# EAGLE design openfc (EAGLE 6.2)
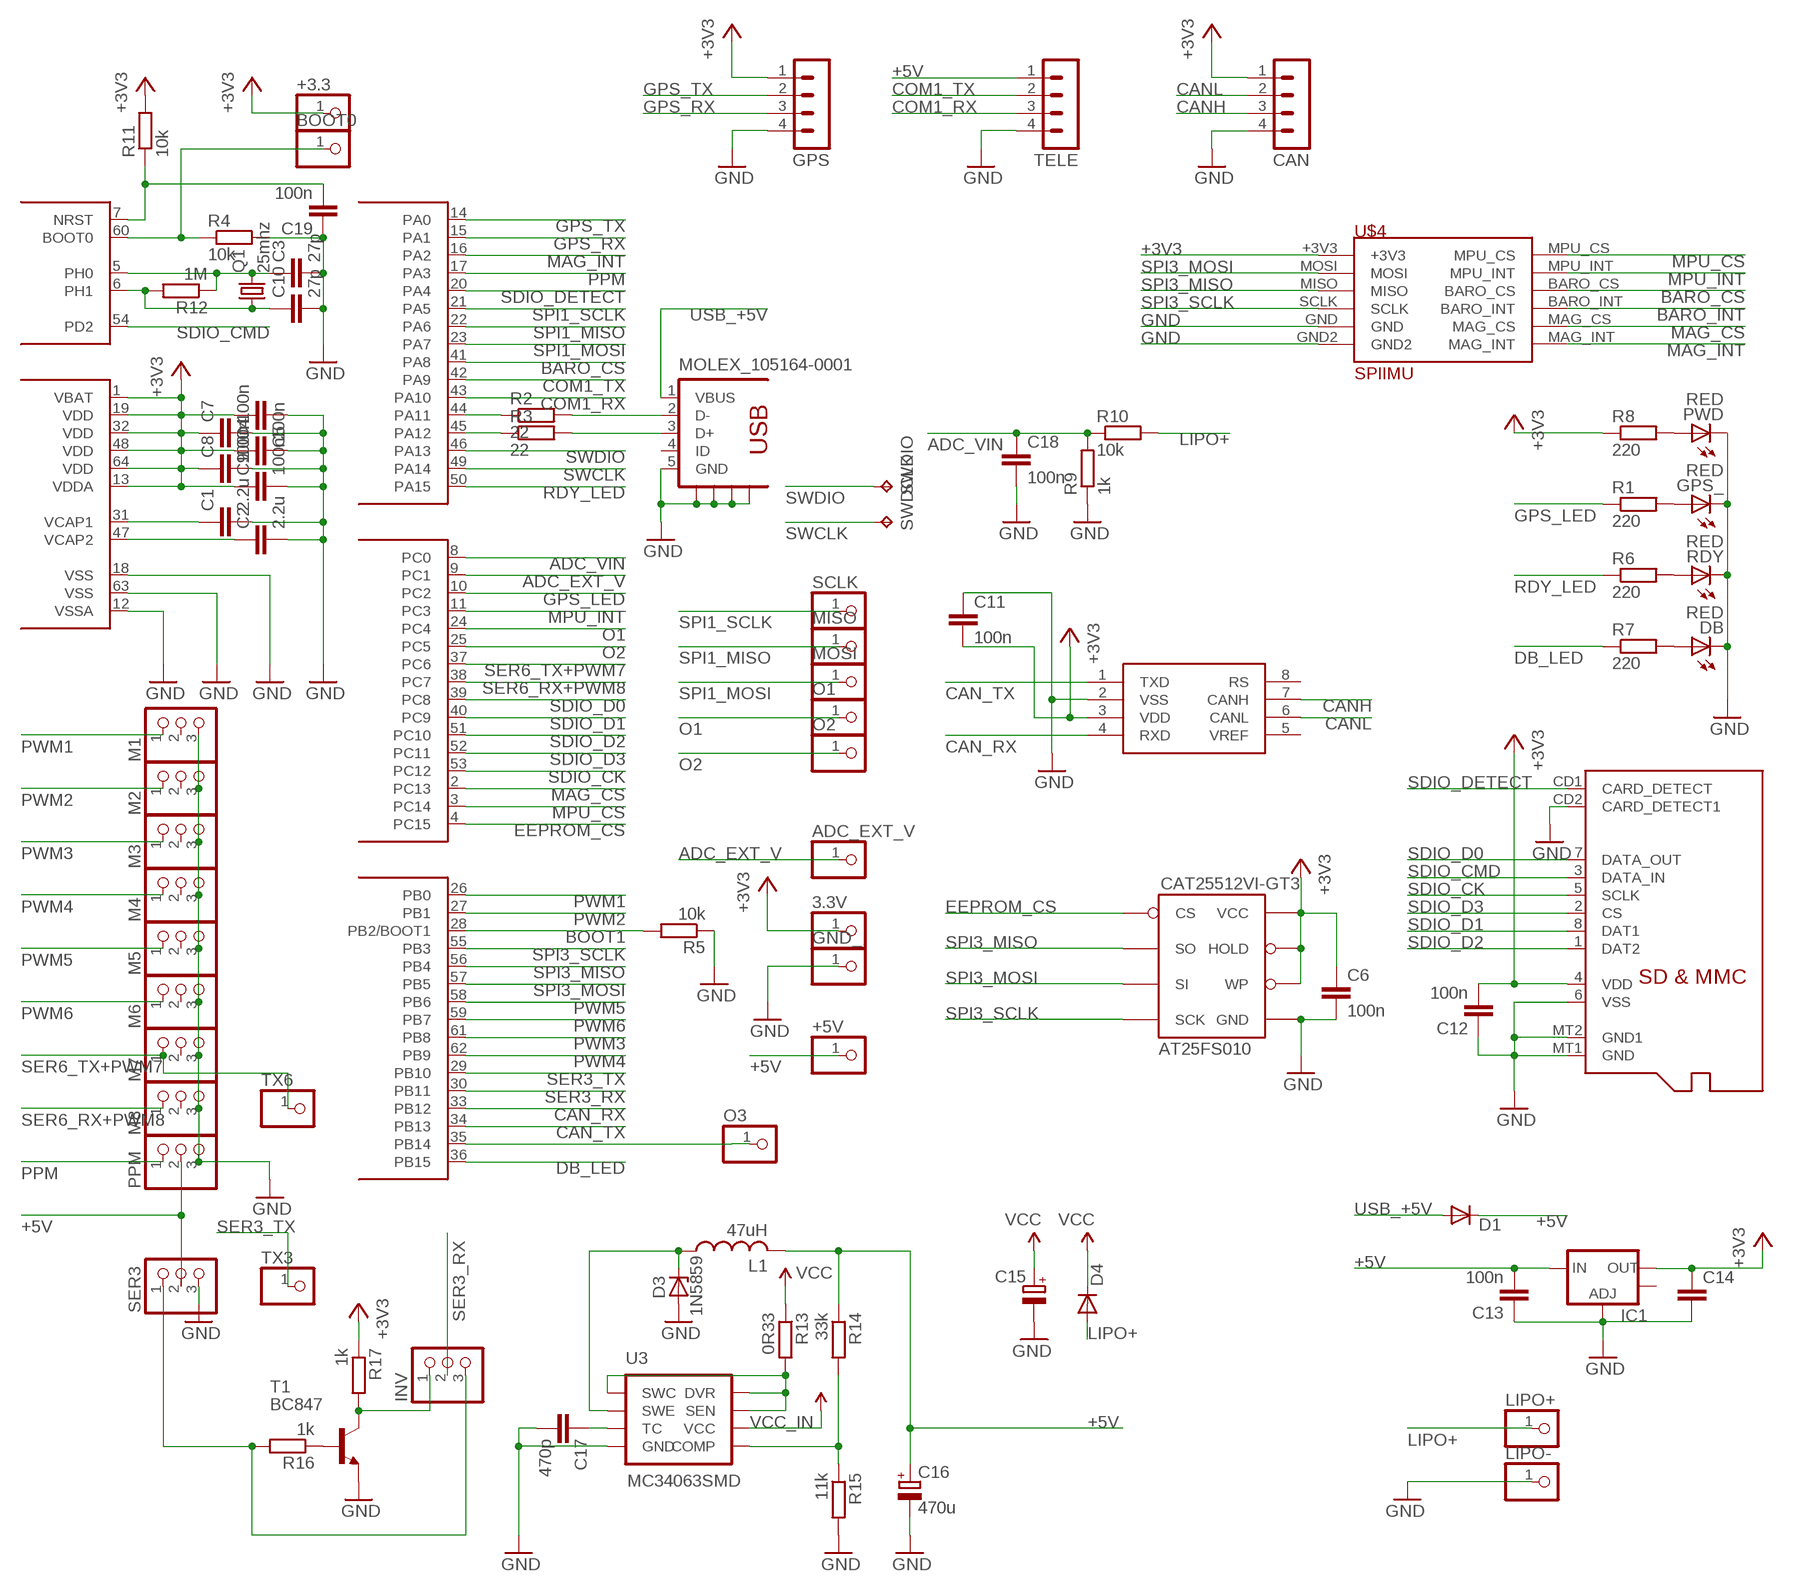
[diagram p0: schematic, sheet 1]

## Parts
3.3V  PINHD-1X1  [1X01]
+3.3  PINHD-1X1  [1X01]
+5V  PINHD-1X1  [1X01]
ADC_EXT_V  PINHD-1X1  [1X01]
BOOT0  PINHD-1X1  [1X01]
C1  2.2u  C-EUC0603  [C0603]
C2  2.2u  C-EUC0603  [C0603]
C3  27p  C-EUC0603  [C0603]
C4  100n  C-EUC0603  [C0603]
C5  100n  C-EUC0603  [C0603]
C6  100n  C-EUC0603  [C0603]
C7  100n  C-EUC0603  [C0603]
C8  100n  C-EUC0603  [C0603]
C9  100n  C-EUC0603  [C0603]
C10  27p  C-EUC0603  [C0603]
C11  100n  C-EUC0603  [C0603]
C12  100n  C-EUC0603  [C0603]
C13  100n  C-EUC0603  [C0603]
C14  C-EUC1206  [C1206]
C15  CPOL-EUB/3528-21R  [B/3528-21R]
C16  470u  CPOL-EUB/3528-21R  [B/3528-21R]
C17  470p  C-EUC0603  [C0603]
C18  100n  C-EUC0603  [C0603]
C19  100n  C-EUC0603  [C0603]
CAN  MA04-1  [MA04-1]
CAT25512VI-GT3  AT25FS010  [SO08WIDE]
D1  DIODE-SMB  [SMB]
D3  1N5859  ZENER-DIODESMB  [SMB]
D4  DIODE-SMB  [SMB]
DB  RED  LED-RED0603  [LED-0603]
GND_  PINHD-1X1  [1X01]
GPS  MA04-1  [MA04-1]
GPS_  RED  LED-RED0603  [LED-0603]
IC1  V_REG_LM1117SOT223  [SOT223]
INV  PINHD-1X3  [1X03]
L1  47uH  L-USL1812  [L1812]
LIPO+  PINHD-1X1  [1X01]
LIPO-  PINHD-1X1  [1X01]
M1  PINHD-1X3  [1X03]
M2  PINHD-1X3  [1X03]
M3  PINHD-1X3  [1X03]
M4  PINHD-1X3  [1X03]
M5  PINHD-1X3  [1X03]
M6  PINHD-1X3  [1X03]
M7  PINHD-1X3  [1X03]
M8  PINHD-1X3  [1X03]
MISO  PINHD-1X1  [1X01]
MOLEX_47334-0001  MICROSD  [MICROSD]
MOLEX_105164-0001  USB-5P  [USB-MINI-B]
MOSI  PINHD-1X1  [1X01]
O1  PINHD-1X1  [1X01]
O2  PINHD-1X1  [1X01]
O3  PINHD-1X1  [1X01]
PPM  PINHD-1X3  [1X03]
PWD  RED  LED-RED0603  [LED-0603]
Q1  25mhz  CRYSTALCTS406  [CTS406]
R1  220  R-EU_R0603  [R0603]
R2  22  R-EU_R0603  [R0603]
R3  22  R-EU_R0603  [R0603]
R4  10k  R-EU_R0603  [R0603]
R5  10k  R-EU_R0603  [R0603]
R6  220  R-EU_R0603  [R0603]
R7  220  R-EU_R0603  [R0603]
R8  220  R-EU_R0603  [R0603]
R9  1k  R-EU_R0603  [R0603]
R10  10k  R-EU_R0603  [R0603]
R11  10k  R-EU_R0603  [R0603]
R12  1M  R-EU_R0603  [R0603]
R13  0R33  R-EU_R0603  [R0603]
R14  33k  R-EU_R0603  [R0603]
R15  11k  R-EU_R0603  [R0603]
R16  1k  R-EU_R0603  [R0603]
R17  1k  R-EU_R0603  [R0603]
RDY  RED  LED-RED0603  [LED-0603]
SCLK  PINHD-1X1  [1X01]
SER3  PINHD-1X3  [1X03]
SWDCLK  TPTP14SQ  [TP14SQ]
SWDIO  TPTP14SQ  [TP14SQ]
T1  BC847  [SOT23]
TELE  MA04-1  [MA04-1]
TX3  PINHD-1X1  [1X01]
TX6  PINHD-1X1  [1X01]
U1  STM32F4-64  [SQFP-S-10X10-64]
U3  MC34063SMD  [SO08]
U4  MCP2551  [SO08]
U$4  SPIIMU  [SPIIMU]

## Nets
+3V3: 3.3V.1 +3.3.1 C4.1 C5.2 C6.1 C7.1 C8.1 C9.1 C11.2 C12.2 C14.1 CAN.1 CAT25512VI-GT3.3(WP) CAT25512VI-GT3.7(HOLD) CAT25512VI-GT3.8(VCC) GPS.1 IC1.2(OUT) MOLEX_47334-0001.4(VDD) R8.1 R11.2 R17.1 U1.1(VBAT) U1.13(VDDA) U1.19(VDD) U1.32(VDD) U1.48(VDD) U1.64(VDD) U4.3(VDD) U$4.+3V3
+5V: +5V.1 C13.2 C16.+ D1.C IC1.3(IN) L1.2 PPM.2 R14.1 SER3.2 TELE.1
ADC_EXT_V: ADC_EXT_V.1 U1.9(PC1)
ADC_VIN: C18.1 R9.2 R10.1 U1.8(PC0)
BARO_CS: U1.41(PA8) U$4.BARO_CS
BARO_INT: U$4.BARO_INT
BOOT0: BOOT0.1 R4.1 U1.60(BOOT0)
BOOT1: R5.2 U1.28(PB2/BOOT1)
CAN_RX: U1.33(PB12) U4.4(RXD)
CAN_TX: U1.34(PB13) U4.1(TXD)
CANH: CAN.3 U4.7(CANH)
CANL: CAN.2 U4.6(CANL)
COM1_RX: TELE.3 U1.43(PA10)
COM1_TX: TELE.2 U1.42(PA9)
DB_LED: R7.1 U1.36(PB15)
EEPROM_CS: CAT25512VI-GT3.1(CS) U1.4(PC15)
GND: C1.2 C2.2 C3.2 C4.2 C5.1 C6.2 C7.2 C8.2 C9.2 C10.2 C11.1 C12.1 C13.1 C14.2 C15.- C16.- C17.2 C18.2 C19.1 CAN.4 CAT25512VI-GT3.4(GND) D3.A DB.C GND_.1 GPS.4 GPS_.C IC1.1(ADJ) LIPO-.1 M1.3 M2.3 M3.3 M4.3 M5.3 M6.3 M7.3 M8.3 MOLEX_47334-0001.6(VSS) MOLEX_47334-0001.CD2(CARD_DETECT1) MOLEX_47334-0001.MT1(GND) MOLEX_47334-0001.MT2(GND1) MOLEX_105164-0001.5(GND) MOLEX_105164-0001.S1 MOLEX_105164-0001.S2 MOLEX_105164-0001.S3 MOLEX_105164-0001.S4 PPM.3 PWD.C R4.2 R5.1 R9.1 R15.2 RDY.C SER3.3 T1.2(E) TELE.4 U1.12(VSSA) U1.18(VSS) U1.63(VSS) U3.4(GND) U4.2(VSS) U$4.GND U$4.GND2
GPS_LED: R1.1 U1.10(PC2)
GPS_RX: GPS.3 U1.15(PA1)
GPS_TX: GPS.2 U1.14(PA0)
LIPO+: D4.A LIPO+.1 R10.2
MAG_CS: U1.2(PC13) U$4.MAG_CS
MAG_INT: U1.16(PA2) U$4.MAG_INT
MPU_CS: U1.3(PC14) U$4.MPU_CS
MPU_INT: U1.11(PC3) U$4.MPU_INT
N$1: C2.1 U1.47(VCAP2)
N$2: C1.1 U1.31(VCAP1)
N$3: C19.2 R11.1 U1.7(NRST)
N$4: PWD.A R8.2
N$5: GPS_.A R1.2
N$6: R6.2 RDY.A
N$7: DB.A R7.2
N$8: R16.1 T1.1(B)
N$9: C3.1 Q1.3 R12.1 U1.5(PH0)
N$10: C10.1 Q1.1 R12.2 U1.6(PH1)
N$13: R2.1 U1.44(PA11)
N$14: R3.1 U1.45(PA12)
N$17: C17.1 U3.3(TC)
N$18: D3.C L1.1 U3.2(SWE)
N$19: R14.2 R15.1 U3.5(COMP)
N$20: R13.2 U3.1(SWC) U3.7(SEN) U3.8(DVR)
O1: O1.1 U1.24(PC4)
O2: O2.1 U1.25(PC5)
O3: O3.1 U1.35(PB14)
PPM: PPM.1 U1.17(PA3)
PWM1: M1.1 U1.26(PB0)
PWM2: M2.1 U1.27(PB1)
PWM3: M3.1 U1.61(PB8)
PWM4: M4.1 U1.62(PB9)
PWM5: M5.1 U1.58(PB6)
PWM6: M6.1 U1.59(PB7)
RDY_LED: R6.1 U1.50(PA15)
SDIO_CK: MOLEX_47334-0001.5(SCLK) U1.53(PC12)
SDIO_CMD: MOLEX_47334-0001.3(DATA_IN) U1.54(PD2)
SDIO_D0: MOLEX_47334-0001.7(DATA_OUT) U1.39(PC8)
SDIO_D1: MOLEX_47334-0001.8(DAT1) U1.40(PC9)
SDIO_D2: MOLEX_47334-0001.1(DAT2) U1.51(PC10)
SDIO_D3: MOLEX_47334-0001.2(CS) U1.52(PC11)
SDIO_DETECT: MOLEX_47334-0001.CD1(CARD_DETECT) U1.20(PA4)
SER3_RX: INV.2 U1.30(PB11)
SER3_RX_INV: INV.1 R17.2 T1.3(C)
SER3_RX_NORM: INV.3 R16.2 SER3.1
SER3_TX: TX3.1 U1.29(PB10)
SER6_RX+PWM8: M8.1 U1.38(PC7)
SER6_TX+PWM7: M7.1 TX6.1 U1.37(PC6)
SPI1_MISO: MISO.1 U1.22(PA6)
SPI1_MOSI: MOSI.1 U1.23(PA7)
SPI1_SCLK: SCLK.1 U1.21(PA5)
SPI3_MISO: CAT25512VI-GT3.2(SO) U1.56(PB4) U$4.MISO
SPI3_MOSI: CAT25512VI-GT3.5(SI) U1.57(PB5) U$4.MOSI
SPI3_SCLK: CAT25512VI-GT3.6(SCK) U1.55(PB3) U$4.SCLK
SWCLK: SWDCLK.TP U1.49(PA14)
SWDIO: SWDIO.TP U1.46(PA13)
USB_+5V: D1.A MOLEX_105164-0001.1(VBUS)
USB_D+: MOLEX_105164-0001.3(D+) R3.2
USB_D-: MOLEX_105164-0001.2(D-) R2.2
VCC_IN: C15.+ D4.C R13.1 U3.6(VCC) ; supply symbol labelled VCC
Unconnected: IC1.4(OUT) M1.2 M2.2 M3.2 M4.2 M5.2 M6.2 M7.2 M8.2 MOLEX_105164-0001.4(ID) U4.5(VREF) U4.8(RS)

## Library data of the parts
3.3V +3.3 +5V ADC_EXT_V BOOT0 GND_ LIPO+ LIPO- MISO MOSI O1-O3 SCLK TX3 TX6 = adafruit:PINHD-1X1: Pin header 1x1 for 0.1" spacing With round pins
C1-C14 C17-C19 = rcl:C-EU: CAPACITOR, European symbol
C15 C16 = rcl:CPOL-EU: POLARIZED CAPACITOR, European symbol
CAN GPS TELE = con-lstb:MA04-1: PIN HEADER; OC_FARNELL: unknown; OC_NEWARK: unknown
CAT25512VI-GT3 = SparkFun-DigitalIC:AT25FS010: 1-Mbit SPI flash memory
D1 D4 = diode:DIODE-: DIODE
D3 = diode:ZENER-DIODE: Z-Diode
DB GPS_ PWD RDY = SparkFun-LED:LED-RED: Assorted Red LEDs LilyPad 1206- DIO-09912 1206- DIO-00809 0603- DIO-00819; PROD_ID: DIO-00819
IC1 = SparkFun-PowerIC:V_REG_LM1117: Voltage Regulator LM1117 Standard adjustable voltage regulator but in SMD form. Spark Fun Electronics SKU : COM-00595
INV M1-M8 PPM SER3 = adafruit:PINHD-1X3: PIN HEADER
L1 = rcl:L-US: INDUCTOR, American symbol
MOLEX_47334-0001 = adafruit:MICROSD: Micro-SD / Transflash card holder with SPI pinout For the 3M # 2908-05WB-MG and/or 4UCON #19656 push-push type
MOLEX_105164-0001 = BaseApp:USB-5P
Q1 = crystal:CRYSTAL: CRYSTAL; OC_FARNELL: unknown; OC_NEWARK: unknown
R1-R17 = resistor:R-EU_: RESISTOR, European symbol
SWDCLK SWDIO = testpad:TP: Test pad
T1 = transistor:BC847: NPN TRANSISTOR
U1 = apbteam_stm32:STM32F4-64: STM32F4, 64 pin package According to STM32F40x datasheet, compatible with STM32F4xx, STM32F2xx. Also compatible with STM32F10x, if VCAP1 and VCAP2 are connected directly to VSS.
U3 = SparkFun:MC34063
U4 = SparkFun-DigitalIC:MCP2551: CAN transceiver
U$4 = spiimu:SPIIMU

## Board
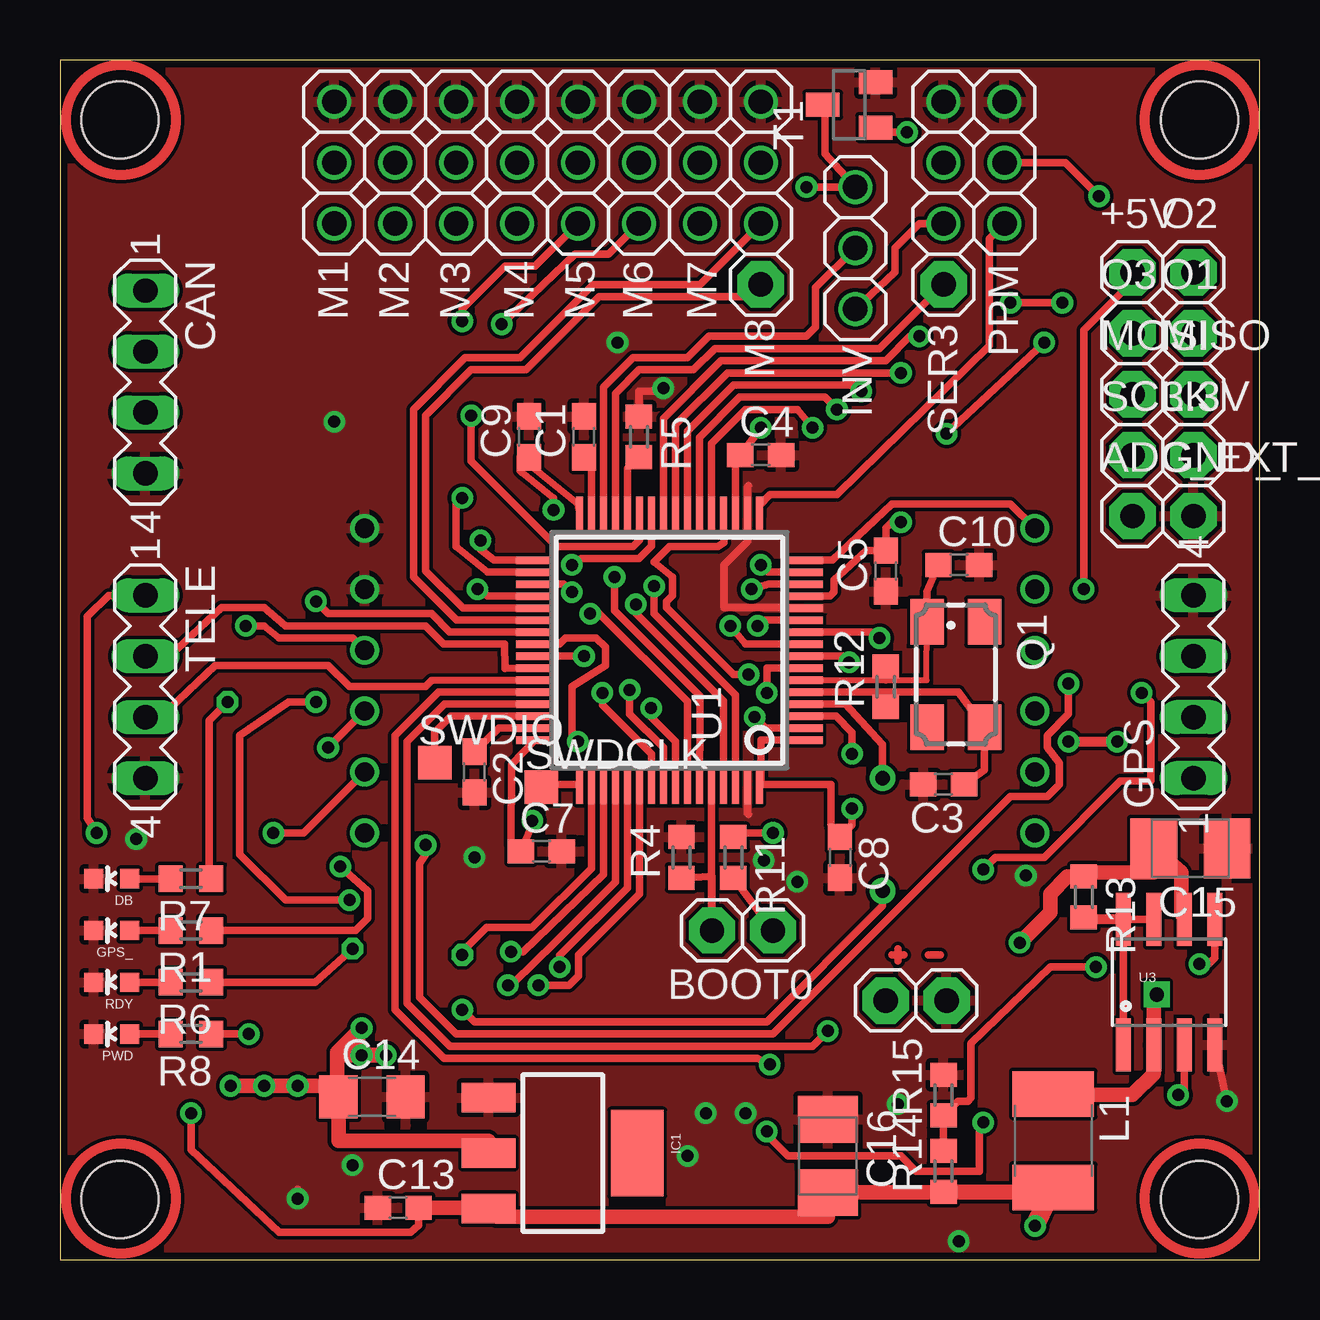
[diagram p1: board, top side]
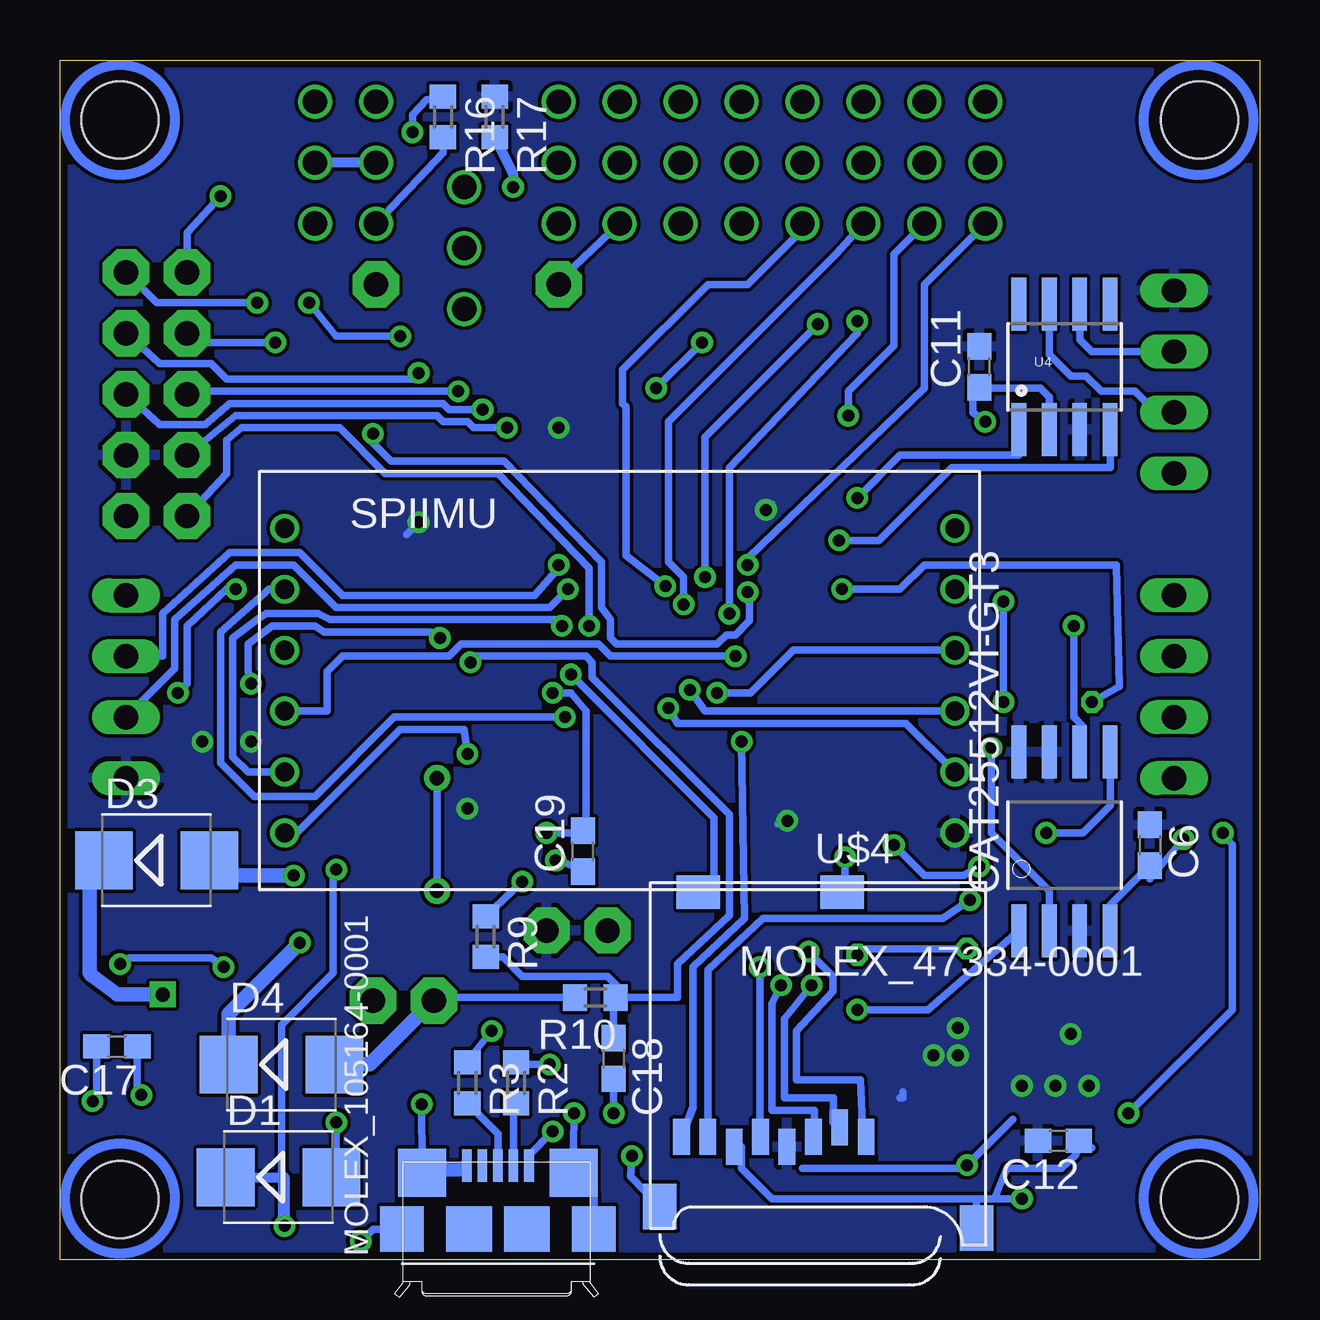
[diagram p2: board, bottom side, seen from below]

Size 50 x 50 mm. Coordinates in mm from the lower left corner, seen from the top.
Outline: 0,0 50,0 50,50 0,50 0,0
Copper layers (1*16): Top 0.035mm / dielectric 1.5mm / Bottom 0.035mm
Design rules: minimum track width 0.15mm, minimum drill 0.3mm, track to track 0.15mm, track to pad 0.15mm, pad to pad 0.15mm, via to via 0.15mm, smd to smd 0.15mm, copper to edge 0.3mm, drill to drill 0.2mm, minimum pad ring 0.2mm, minimum via ring 0.15mm, stop-mask expansion 0.075mm, vias tented up to drill 0mil, thermal gap 0.2mm
Holes 3.2 mm at 2.5,47.5 47.5,47.5 47.5,2.5 2.5,2.5

### Footprints (pad centres in the part's own frame; a part is rotated, then mirrored left to right if it is on the bottom)
1X01 = drill 1.016 pad 1.93 octagon: 1 0,0
C0603 = smd 1.1 x 1: 1 -0.85,0; 2 0.85,0
C1206 = smd 1.6 x 1.8: 1 -1.4,0; 2 1.4,0
B/3528-21R = smd 1.95 x 2.5: + 1.525,0; - -1.525,0
MA04-1 = drill 1.016 long: 1 -3.81,0; 2 -1.27,0; 3 1.27,0; 4 3.81,0
SO08WIDE = smd 0.61 x 2.21: 1 -1.905,-3.569; 2 -0.635,-3.569; 3 0.635,-3.569; 4 1.905,-3.569; 5 1.905,3.886; 6 0.635,3.886; 7 -0.635,3.886; 8 -1.905,3.886
SMB = smd 2.4 x 2.4: A 2.2,0; C -2.2,0
LED-0603 = smd 0.8 x 0.8: A 0,-0.75; C 0,0.75
SOT223 = smd 1.219 x 2.235: 1 -2.311,-3.099; 2 0,-3.099; 3 2.311,-3.099 | smd 3.6 x 2.2: 4 0,3.099
1X03 = drill 1.016: 1 -2.54,0; 2 0,0; 3 2.54,0
L1812 = smd 1.9 x 3.4: 1 -1.95,0; 2 1.95,0
MICROSD = smd 0.7 x 1.5: 1 9,-10.64; 2 7.9,-10.24; 3 6.8,-10.64; 4 5.7,-11.04; 5 4.6,-10.64; 6 3.5,-11.04; 7 2.4,-10.64; 8 1.3,-10.64 | smd 1.8 x 1.4: CD1 2,-0.44; CD2 8,-0.44 | smd 1.4 x 1.9: MT1 0.4,-13.54; MT2 13.6,-14.44
USB-MINI-B = smd 0.4 x 1.35: 1 1.3,2.65; 2 0.65,2.65; 3 0,2.65; 4 -0.65,2.65; 5 -1.3,2.65 | smd 1.9 x 1.9: M1 -1.2,0; M2 1.2,0 | smd 1.8 x 1.9: S1 -4,0; S2 4,0 | smd 2 x 2: S3 -3.15,2.35; S4 3.15,2.35
CTS406 = smd 1.9 x 1.4: 1 -2.2,-1.2; 2 2.2,-1.2; 3 2.2,1.2; 4 -2.2,1.2
R0603 = smd 1 x 1.1: 1 -0.85,0; 2 0.85,0
TP14SQ = smd 1.4 x 1.4: TP 0,0
SOT23 = smd 1 x 1.4: 1 -0.95,-1.1; 2 0.95,-1.1; 3 0,1.1
SQFP-S-10X10-64 = smd 0.3 x 1.6: 1 -3.75,-5.6; 2 -3.25,-5.6; 3 -2.75,-5.6; 4 -2.25,-5.6; 5 -1.75,-5.6; 6 -1.25,-5.6; 7 -0.75,-5.6; 8 -0.25,-5.6; 9 0.25,-5.6; 10 0.75,-5.6; 11 1.25,-5.6; 12 1.75,-5.6; 13 2.25,-5.6; 14 2.75,-5.6; 15 3.25,-5.6; 16 3.75,-5.6; 33 3.75,5.6; 34 3.25,5.6; 35 2.75,5.6; 36 2.25,5.6; 37 1.75,5.6; 38 1.25,5.6; 39 0.75,5.6; 40 0.25,5.6; 41 -0.25,5.6; 42 -0.75,5.6; 43 -1.25,5.6; 44 -1.75,5.6; 45 -2.25,5.6; 46 -2.75,5.6; 47 -3.25,5.6; 48 -3.75,5.6 | smd 1.6 x 0.3: 17 5.6,-3.75; 18 5.6,-3.25; 19 5.6,-2.75; 20 5.6,-2.25; 21 5.6,-1.75; 22 5.6,-1.25; 23 5.6,-0.75; 24 5.6,-0.25; 25 5.6,0.25; 26 5.6,0.75; 27 5.6,1.25; 28 5.6,1.75; 29 5.6,2.25; 30 5.6,2.75; 31 5.6,3.25; 32 5.6,3.75; 49 -5.6,3.75; 50 -5.6,3.25; 51 -5.6,2.75; 52 -5.6,2.25; 53 -5.6,1.75; 54 -5.6,1.25; 55 -5.6,0.75; 56 -5.6,0.25; 57 -5.6,-0.25; 58 -5.6,-0.75; 59 -5.6,-1.25; 60 -5.6,-1.75; 61 -5.6,-2.25; 62 -5.6,-2.75; 63 -5.6,-3.25; 64 -5.6,-3.75
SO08 = smd 0.61 x 2.21: 1 -1.905,-2.616; 2 -0.635,-2.616; 3 0.635,-2.616; 4 1.905,-2.616; 5 1.905,2.616; 6 0.635,2.616; 7 -0.635,2.616; 8 -1.905,2.616
SPIIMU = drill 0.8: +3V3 -13.97,6.35; BARO_CS 13.97,1.27; BARO_INT 13.97,-1.27; GND -13.97,-3.81; GND2 -13.97,-6.35; MAG_CS 13.97,-3.81; MAG_INT 13.97,-6.35; MISO -13.97,1.27; MOSI -13.97,3.81; MPU_CS 13.97,6.35; MPU_INT 13.97,3.81; SCLK -13.97,-1.27

### Placement (x,y rotation side)
3.3V  47.24,33.53 0 top
+3.3  29.72,13.72 270 top
+5V  44.7,41.15 0 top
ADC_EXT_V  44.7,30.99 0 top
BOOT0  27.18,13.72 90 top
C1  21.84,34.29 90 top
C2  17.27,20.32 270 top
C3  36.83,19.81 180 top
C4  29.21,33.53 0 top
C5  34.42,28.7 90 top
C6  4.57,17.27 270 bottom
C7  20.07,17.02 0 top
C8  32.51,16.76 270 top
C9  19.56,34.29 90 top
C10  37.47,28.96 0 top
C11  11.68,37.21 90 bottom
C12  8.38,4.95 180 bottom
C13  14.1,2.16 0 top
C14  13.01,6.78 0 top
C15  47.12,17.14 180 top
C16  32,4.32 270 top
C17  47.62,8.89 180 bottom
C18  26.92,8.38 270 bottom
C19  28.19,17.02 90 bottom
CAN  3.56,36.58 270 top
CAT25512VI-GT3  8.13,17.27 0 bottom
D1  40.89,3.43 0 bottom
D3  45.97,16.64 0 bottom
D4  40.77,8.13 0 bottom
DB  2.16,15.88 90 top
GND_  47.24,30.99 0 top
GPS  47.24,23.88 90 top
GPS_  2.16,13.72 90 top
IC1  20.96,4.44 270 top
INV  33.15,42.16 270 top
L1  41.4,4.95 270 top
LIPO+  34.42,10.79 0 top
LIPO-  36.96,10.79 0 top
M1  11.43,45.72 90 top
M2  13.97,45.72 90 top
M3  16.51,45.72 90 top
M4  19.05,45.72 90 top
M5  21.59,45.72 90 top
M6  24.13,45.72 90 top
M7  26.67,45.72 90 top
M8  29.21,45.72 90 top
MISO  47.24,36.07 0 top
MOLEX_47334-0001  25.4,15.75 0 bottom
MOLEX_105164-0001  31.75,1.27 0 bottom
MOSI  44.7,36.07 0 top
O1  47.24,38.61 0 top
O2  47.24,41.15 0 top
O3  44.7,38.61 0 top
PPM  39.37,45.72 90 top
PWD  2.16,9.4 90 top
Q1  37.34,24.38 270 top
R1  5.46,13.72 180 top
R2  30.99,7.37 270 bottom
R3  33.02,7.37 270 bottom
R4  25.91,16.76 90 top
R5  24.13,34.29 270 top
R6  5.46,11.56 180 top
R7  5.46,15.88 180 top
R8  5.46,9.4 180 top
R9  32.26,13.46 270 bottom
R10  27.69,10.92 180 bottom
R11  28.07,16.76 270 top
R12  34.42,23.88 90 top
R13  42.67,15.11 270 top
R14  36.83,3.68 90 top
R15  36.83,6.86 90 top
R16  34.04,47.62 270 bottom
R17  31.88,47.62 270 bottom
RDY  2.16,11.56 90 top
SCLK  44.7,33.53 0 top
SER3  36.83,45.72 90 top
SWDCLK  20.07,19.68 0 top
SWDIO  15.62,20.7 0 top
T1  32.89,48.13 90 top
TELE  3.56,23.88 270 top
TX3  36.83,40.64 0 top
TX6  29.21,40.64 0 top
U1  25.4,25.4 90 top
U3  46.23,11.56 0 top
U4  8.13,37.21 0 bottom
U$4  26.67,24.13 180 bottom

### Tracks (layer width: path | path; a pad name or v marks a point on that pad's centre or on a via)
+3V3  (via drill 0.5)
  Top 0.305: U1.64 29.22,19.8 | 29.22,19.8 32.13,19.8 32.13,18.16 32.26,17.53 C8.1 33.02,18.12 v33.02,18.8 | U1.32 21.65,31.18 21.59,31.5 19.72,33.02 C9.1 19.18,33.44 19.18,32.89 19.27,32.8 20.57,31.75 v20.57,31.24 | 28.15,33.23 28.15,33.65 C4.1 28.03,33.53 | U1.48 18.82,20.63 18.8,17.27 19.05,17.02 C7.1 19.65,18.07 v19.68,18.29 | U1.19 28.15,33.23 | 28.15,33.23 28.19,33.27 v29.21,34.67 | U1.13 32.09,27.65 32.26,27.81 32.26,28.32 33.62,29.55 34.47,29.55 C5.2 34.42,30.48 34.67,30.73 v35.05,30.73 | R11.2 +3.3.1 | U1.1 29.22,21.65 29.22,19.8 | 11.68,6.86 11.56,6.99 11.3,7.24 v9.91,7.24 9.87,7.28 | 11.56,8.64 12.57,9.14 v12.57,8.51 12.7,8.51 | R8.1 v7.87,9.4
  Top 0.406: v42.04,21.59 v44.07,21.59
  Top 0.61: IC1.2 17.86,4.95 11.61,4.95 C14.1 11.15,7.24 v7.11,7.24 | v12.57,9.65 11.56,8.64 v13.59,8.51 12.7,8.51 11.56,8.51 11.56,6.99
  Bottom 0.305: v35.05,30.73 35.56,30.23 | v19.68,18.29 20.07,18.16 | v20.57,31.24 20.32,31.5 | 14.99,6.73 14.86,6.73 14.86,6.99 | v9.91,7.24 9.78,7.37 9.91,7.41 9.99,7.37 | U4.3 7.49,34.54 | v7.87,9.4 7.87,9.27
  other vias: 8.51,7.24
  pour Bottom: -13.97,62.23 60.96,62.23 60.96,-24.13 -13.97,-24.13
+5V  (via drill 0.5)
  Top 0.305: PPM.2 41.91,45.72 v43.31,44.32 | v42.67,27.94 42.67,38.73 44.7,40.77 +5V.1 | v1.52,17.78 1.14,18.41 1.14,26.8 2.03,27.69 TELE.1 | 40.64,3.81 L1.2 40.47,2.83 | R14.1 36.79,2.79 | v45.09,23.62 45.47,23.24 45.47,19.94 44.2,19.94 41.02,16.76 38.99,16.76 v38.48,16.26 | v5.46,6.1 5.46,4.57 9.14,1.14 14.61,1.14 14.95,1.44 C13.2 | IC1.3 18.21,1.78 | 31.75,2.41 C16.+
  Top 0.61: 18.21,1.78 32,1.78 C16.+ 40.47,2.79 40.47,2.83 | R14.1 41.4,2.83 L1.2 | C13.2 17.83,2.16 IC1.3
  Top 0.813: v40.64,1.4 L1.2
  Bottom 0.305: v42.67,27.94 43.05,27.94 44.7,26.42 44.7,24 v45.09,23.62 | v38.48,16.26 38.61,16 38.61,11.94 40.77,9.78 40.77,1.14 v40.64,1.4 | v1.52,17.78 1.14,17.27 1.14,10.41 v5.46,6.1 | v43.31,44.32 44.7,42.8 +5V.1
  Bottom 0.406: SER3.2 PPM.2 | D1.C 40.64,3.43 v40.64,1.4
ADC_EXT_V  (via drill 0.5)
  Top 0.305: U1.9 28.58,25.65 v27.94,26.42
  Bottom 0.305: v27.94,26.42 27.94,28.83 31.75,32.77 36.45,32.77 38.35,34.67 42.42,34.67 43.05,34.16 43.05,32.77 ADC_EXT_V.1 44.45,31.11
ADC_VIN  (via drill 0.5)
  Top 0.305: U1.8 32.63,25.15 v32.89,24.89
  Bottom 0.305: v32.89,24.89 32.64,24.89 32.77,25.15 28.07,25.15 27.81,24.89 27.81,24.26 22.1,18.54 22.1,14.35 24.26,12.32 24.26,10.92 R10.1 | R10.1 26.92,10.92 C18.1 | R10.1 26.8,11.43 27.18,11.81 30.73,11.81 31.54,12.61 R9.2
BARO_CS  (via drill 0.5)
  Top 0.305: U1.41 21.09,25.15 v21.84,25.15
  Bottom 0.305: v21.84,25.15 27.05,25.15 27.56,25.65 33.27,25.65 33.78,25.15 38.23,25.15 38.86,24.51 38.86,22.86 U$4.BARO_CS
BOOT0
  Top 0.305: U1.60 27.15,13.74 BOOT0.1 27.18,15.96 R4.1
BOOT1
  Top 0.305: U1.28 23.65,32.96 R5.2
CAN_RX  (via drill 0.5)
  Top 0.305: U1.33 18.09,29.15 17.53,29.59 v17.53,29.97
  Bottom 0.305: v17.53,29.97 15.88,29.97 12.83,33.02 6.22,33.02 U4.4
CAN_TX  (via drill 0.5)
  Top 0.305: U1.34 17.83,28.65 16.51,29.72 16.51,31.5 v16.76,31.75
  Bottom 0.305: v16.76,31.75 14.99,33.53 10.03,33.53 U4.1
CANH
  Bottom 0.305: CAN.3 4.32,35.31 5.21,36.2 6.6,36.2 7.24,36.83 7.87,36.83 8.76,37.72 U4.7
CANL
  Bottom 0.305: CAN.2 6.99,37.85 7.49,38.35 U4.6
COM1_RX
  Top 0.305: U1.43 15.49,24.13 15.24,23.88 12.06,23.88 11.18,24.77 6.48,24.77 4.19,22.61 TELE.3
COM1_TX
  Top 0.305: U1.42 18.54,24.64 18.53,25.67 15.99,25.67 15.24,26.42 9.4,26.42 8.51,27.18 6.73,27.18 4.57,25.15 TELE.2
DB_LED  (via drill 0.5)
  Top 0.305: U1.36 17.82,27.65 v17.4,27.94 | v6.99,23.24 6.22,22.48 6.22,15.71 R7.1
  Bottom 0.305: v17.4,27.94 14.99,27.94 13.97,28.96 5.97,28.96 5.84,23.88 v6.99,23.24
EEPROM_CS  (via drill 0.5, 0.6)
  Top 0.305: U1.4 32.73,23.15 34.29,21.46 v34.29,20.07 | v16.76,10.41 17.27,9.91 29.46,9.91 34.29,14.73 v34.29,15.37
  Bottom 0.305: v16.76,10.41 13.83,10.41 CAT25512VI-GT3.1 | v34.29,20.07 v34.29,15.37
GND  (via drill 0.5)
  Top 0.305: 28.7,32.26 28.65,32.21 U1.18 28.65,29.92 27.69,28.96 27.69,27.18 30.97,27.18 U1.12 | U1.63 28.65,18.59 28.7,18.54 | v34.92,6.48 35.18,6.6 | v3.17,17.53 3.05,17.65 | 12.19,3.81 v12.19,3.94 12.19,4.06 | v17.27,16.76 17.27,16.64 | 30.73,16 v30.73,15.75 | v40.26,16 40.51,16.13 | v9.91,2.54 9.91,2.92 | v48.64,6.6 U3.4 | R5.1 24.13,36.2 24.77,36.2 v25.15,36.32 | v23.24,38.23 22.99,38.1 | v11.43,34.92 11.56,34.8 | v29.34,16.64 29.34,16.76
  Bottom 0.305: MOLEX_105164-0001.S3 33.35,3.62 MOLEX_105164-0001.5 34.91,3.92 v34.92,6.48 | MOLEX_105164-0001.S2 27.75,2.77 28.6,2.77 MOLEX_105164-0001.S4 28.6,4.67 v28.57,6.1 | 24.92,1.78 MOLEX_47334-0001.MT1 26.21,3.48 v26.16,4.32 | CAT25512VI-GT3.4 6.22,14.77 C6.2 4.57,15.88 v3.17,17.53 | 11.05,2.54 10.54,3.81 8.26,3.81 7.66,4.36 C12.1 6.99,4.66 | 11.05,2.54 11.81,2.54 | 11.81,2.54 20.32,2.54 21.59,3.81 21.59,4.71 MOLEX_47334-0001.6 | 19.05,3.81 12.45,3.81 12.32,3.94 v12.19,3.94 10.29,5.84 | MOLEX_47334-0001.CD2 17.27,15.56 v17.27,16.76 | MOLEX_47334-0001.MT2 11.8,2.04 11.81,2.54 | MOLEX_105164-0001.S1 36.96,1.27 v37.47,0.76 | R9.1 v30.73,15.75 | D3.A 43.39,16.26 | 11.05,2.54 v9.91,2.54 | C17.2 48.48,7.07 v48.64,6.6 | v25.15,36.32 v23.24,38.23 | C11.1 11.94,36.2 | v11.43,34.92 11.94,35.31 11.94,36.2 | 11.94,36.2 11.81,36.32 9.14,36.32 8.76,35.94 U4.2 | 26.92,7.79 C18.2 v26.92,6.1 | C19.1 29.21,16.68 v29.34,16.64
  Bottom 0.61: 43.39,16.26 43.43,16 v40.26,16
  pour Top: -11.43,59.69 53.85,59.82 53.85,-18.92 -11.43,-19.05
GPS_LED  (via drill 0.5)
  Top 0.305: U1.10 33.79,26.15 v34.16,25.91 | R1.1 12.32,13.72 12.83,14.22 12.83,15.37 v11.68,16.38 | v15.24,17.27 15.24,16.89 14.99,16.51 14.99,10.92 16.51,9.4 29.72,9.4 39.62,19.3 41.15,19.3 41.66,19.81 41.66,20.7 41.15,21.34 41.15,21.84 42.04,22.73 v42.04,24
  Bottom 0.305: v34.16,25.91 34.54,26.16 38.99,26.16 39.37,26.42 41.15,26.42 42.16,25.65 42.16,24.51 v42.04,24 | v11.68,16.38 12.32,16 13.97,16 v15.24,17.27
GPS_RX  (via drill 0.5)
  Top 0.305: U1.15 29.52,28.65 v29.21,28.96
  Bottom 0.305: v29.21,28.96 29.21,28.83 30.23,27.69 38.23,27.69 40.01,29.46 42.93,29.46 45.72,26.92 45.72,25.15 GPS.3
GPS_TX  (via drill 0.5)
  Top 0.305: U1.14 29.55,28.15 v28.83,27.94
  Bottom 0.305: v28.83,27.94 29.59,27.18 38.48,27.18 40.26,28.96 42.67,28.96 45.21,26.67 45.21,24.64 GPS.2
LIPO+
  Bottom 0.305: R10.2 34.67,10.92 LIPO+.1
  Bottom 0.61: D4.A 37.08,8.13 LIPO+.1
MAG_CS  (via drill 0.5)
  Top 0.305: U1.2 29.41,22.15 v28.96,22.61
  Bottom 0.305: v28.96,22.61 36.07,22.61 39.37,19.3 41.91,19.3 43.31,20.7 43.31,26.16 41.27,27.94 U$4.MAG_CS
MAG_INT
  Top 0.305: U1.16 32.2,29.15 34.67,31.5 39.62,31.5 U$4.MAG_INT
MPU_CS  (via drill 0.5)
  Top 0.305: U1.3 32.34,22.65 33.02,21.97 v33.02,21.08
  Bottom 0.305: v33.02,21.08 33.15,22.1 35.81,22.1 40.13,17.78 U$4.MPU_CS
MPU_INT  (via drill 0.5)
  Top 0.305: U1.11 29.34,26.65 v29.08,26.42
  Bottom 0.305: v29.08,26.42 29.34,26.67 38.73,26.67 39.24,26.92 41.4,26.92 41.78,26.67 42.8,25.91 42.8,20.95 42.16,20.32 U$4.MPU_INT
N$1
  Top 0.305: U1.47 18.3,22.15 C2.1
N$2
  Top 0.305: U1.31 22.15,33.64 C1.1
N$3  (via drill 0.5)
  Top 0.305: U1.7 29.46,24.65 v29.46,23.62 | v29.72,17.78 28.36,17.78 R11.1
  Bottom 0.305: v29.46,23.62 28.7,23.62 28.07,22.86 28.07,17.78 v29.72,17.78
  Bottom 0.406: 28.07,17.78 28.19,17.78 C19.2
N$4
  Top 0.305: PWD.A R8.2
N$5
  Top 0.305: GPS_.A R1.2
N$6
  Top 0.305: R6.2 RDY.A
N$7
  Top 0.305: DB.A R7.2
N$8  (via drill 0.5)
  Top 0.305: T1.1 34.31,46.99 v35.31,46.99
  Bottom 0.305: v35.31,46.99 35.31,47.71 34.71,48.35 R16.1
N$9
  Top 0.305: 37.65,19.78 C3.1 38.54,20.42 Q1.3 37.45,23.65 34.67,23.65 | U1.5 34.67,23.65 | R12.1 34.67,23.03 34.67,23.65
N$10
  Top 0.254: U1.6 34.42,24.15 36.12,24.15 Q1.1
  Top 0.305: Q1.1 36.14,27.84 C10.1 | R12.2 34.42,24.15
N$13  (via drill 0.5)
  Top 0.305: U1.44 15.78,23.65 13.97,21.84 13.97,10.41 16,8.38 29.08,8.38 v29.59,8.13
  Bottom 0.305: v29.59,8.13 30.9,8.13 R2.1
N$14  (via drill 0.5)
  Top 0.305: U1.45 16.04,23.15 14.48,21.59 14.48,10.67 16.26,8.89 31.37,8.89 v32,9.53
  Bottom 0.305: v32,9.53 33.11,8.13 R3.1
N$17  (via drill 0.5)
  Top 0.305: 46.77,9.07 U3.3 46.86,6.99 v46.61,6.86
  Bottom 0.305: C17.1 46.77,6.9 v46.61,6.86
N$18  (via drill 0.6)
  Top 0.61: L1.1 41.45,6.86 44.7,6.86 45.59,7.75 U3.2 45.59,10.67 45.72,10.79 v45.72,11.05
  Bottom 0.61: D3.C 48.77,16.64 48.77,11.94 48.68,11.85 47.62,11.05 v45.72,11.05
N$19  (via drill 0.5)
  Top 0.305: U3.5 48.13,12.57 47.88,12.32 v47.5,12.32 | R14.2 R15.1 37.43,6.6 37.85,6.6 37.97,6.73 37.97,9.02 41.27,12.19 v43.18,12.19
  Bottom 0.305: v47.5,12.32 47.37,12.32 47.12,12.57 43.69,12.57 v43.18,12.19
N$20
  Top 0.305: U3.7 U3.8 U3.1
  Top 0.406: U3.8 42.67,14.17 R13.2
O1  (via drill 0.5)
  Top 0.305: U1.24 25.65,34.79 27.81,36.96 v35.05,36.96
  Bottom 0.305: v35.05,36.96 35.31,36.7 43.05,36.7 43.69,37.34 45.85,37.34 O1.1
O2  (via drill 0.5)
  Top 0.305: U1.25 25.15,35.06 27.56,37.47 34.42,37.47 35.43,38.48 v35.81,38.48 | v39.62,39.88 v41.78,39.88
  Bottom 0.305: v35.81,38.48 38.48,38.48 v39.62,39.88 | v41.78,39.88 45.97,39.88 O2.1
O3  (via drill 0.5)
  Top 0.305: U1.35 21,28.15 v21.34,27.81 | v36.96,34.42 v41.02,38.23
  Bottom 0.305: 21.21,27.69 v21.34,27.81 21.25,27.73 21.25,26.63 21.84,26.04 22.23,26.04 22.61,25.65 26.8,25.65 27.05,25.91 27.05,26.67 27.43,27.18 27.43,29.08 31.5,33.27 36.2,33.27 36.96,34.04 v36.96,34.42 | v41.02,38.23 44.2,38.23 O3.1
PPM
  Top 0.305: U1.17 29.15,31.44 29.59,31.88 32.38,31.88 38.73,38.1 38.73,42.55 PPM.1
PWM1  (via drill 0.5)
  Top 0.305: U1.26 24.65,29.73 24.13,29.21 21.72,29.21 v21.34,28.96
  Bottom 0.305: v21.34,28.96 21.34,29.21 13.97,36.32 13.97,40.64 M1.1
PWM2  (via drill 0.5)
  Top 0.305: U1.27 24.15,29.99 23.88,29.72 20.7,29.72 17.14,33.27 v17.14,35.18
  Bottom 0.305: v17.14,35.18 17.14,36.2 15.24,38.1 15.24,41.91 M2.1
PWM3  (via drill 0.5)
  Top 0.305: U1.61 27.65,23.28 24,26.92 v24,27.3
  Bottom 0.305: v24,27.3 24,28.45 24.64,29.08 24.64,34.92 17.65,41.91 M3.1
PWM4  (via drill 0.5)
  Top 0.305: U1.62 28.15,23.54 24.77,26.92 v24.77,28.07
  Bottom 0.305: v24.77,28.07 26.42,29.34 26.42,35.56 26.54,35.69 26.54,37.08 22.99,40.64 21.34,40.64 19.43,42.55 19.05,43.05 M4.1
PWM5  (via drill 0.5)
  Top 0.305: U1.58 26.15,23.25 22.48,26.92 v22.1,26.92 | v16.76,39.12 16.76,39.62 18.54,41.4 19.81,41.4 M5.1
  Bottom 0.305: v22.1,26.92 22.1,33.02 16.76,38.61 v16.76,39.12
PWM6  (via drill 0.5)
  Top 0.305: U1.59 26.65,21.06 26.67,21.34 26.67,23.5 23.11,27.05 v23.11,28.45 | v18.41,38.99 18.8,39.37 21.46,41.91 22.86,41.91 M6.1
  Bottom 0.305: v23.11,28.45 23.11,34.29 v18.41,38.99
RDY_LED  (via drill 0.5)
  Top 0.305: U1.50 22.15,16.31 19.68,13.84 17.78,13.84 16.76,12.83 v16.76,12.7 | v12.19,12.95 10.63,11.56 R6.1
  Bottom 0.305: v16.76,12.7 16.89,12.95 v12.19,12.95
SDIO_CK  (via drill 0.5)
  Top 0.305: U1.53 23.65,15.49 20.83,12.67 v20.83,12.19
  Bottom 0.305: v20.83,12.19 20.83,4.63 MOLEX_47334-0001.5
SDIO_CMD  (via drill 0.5)
  Top 0.305: U1.54 24.15,15.24 21.61,12.7 21.61,11.83 21.21,11.43 v19.94,11.43
  Bottom 0.305: v19.94,11.43 20.32,10.67 20.32,6.22 18.54,6.22 18.54,4.8 MOLEX_47334-0001.3
SDIO_D0  (via drill 0.5)
  Top 0.305: U1.39 16.24,26.15 15.49,26.92 11.18,26.92 v10.67,27.43 | v10.67,23.24 9.53,23.24 7.49,21.84 7.49,16.89 9.4,14.99 v12.06,14.99
  Bottom 0.305: v10.67,27.43 v10.67,23.24 | v12.06,14.99 13.21,14.22 20.7,14.22 22.99,12.06 22.99,4.84 MOLEX_47334-0001.7
SDIO_D1  (via drill 0.5)
  Top 0.305: U1.40 20.82,25.65 21.08,25.91 22.35,25.91 22.73,25.53 22.73,24.77 21.34,23.88 21.34,21.84 v21.59,21.59
  Bottom 0.305: v21.59,21.59 21.46,14.22 23.62,12.19 23.62,6.35 MOLEX_47334-0001.8
SDIO_D2  (via drill 0.5)
  Top 0.305: U1.51 22.65,16.05 19.3,12.83 v18.8,12.83
  Bottom 0.305: v18.8,12.83 17.78,11.81 17.78,11.18 19.3,9.53 19.3,7.49 16.64,7.49 16.51,4.74 MOLEX_47334-0001.1
SDIO_D3  (via drill 0.5)
  Top 0.305: U1.52 23.15,15.75 20.61,13.21 18.92,11.56 v18.67,11.43
  Bottom 0.305: v18.67,11.43 19.81,10.03 19.81,6.73 17.75,6.73 17.78,5.71 17.57,5.51 MOLEX_47334-0001.2
SDIO_DETECT  (via drill 0.5)
  Top 0.305: U1.20 27.69,29.89 27.43,29.72 25.4,29.72 24.77,29.08 25.53,28.45 25.53,27.69 25.27,27.43 25.27,27.18 28.07,24.38 v28.7,24.38
  Bottom 0.305: v28.7,24.38 22.73,18.41 22.73,15.78 MOLEX_47334-0001.CD1
SER3_RX
  Top 0.305: U1.30 22.65,36.37 23.88,37.59 26.16,37.59 27.05,38.48 31.11,38.48 31.5,38.86 31.5,40.51 INV.2
SER3_RX_INV  (via drill 0.5)
  Top 0.305: T1.3 31.88,47.92 31.88,46.1 INV.1 v31.11,44.7
  Bottom 0.406: R17.2 31.11,45.25 v31.11,44.7
SER3_RX_NORM
  Top 0.305: SER3.1 35.81,43.18 34.8,42.16 34.8,41.15 INV.3
  Bottom 0.305: R16.2 34.04,46.14 SER3.1
SER3_TX
  Top 0.305: U1.29 23.15,36.1 24.13,37.08 26.42,37.08 27.3,37.97 34.16,37.97 TX3.1
SER6_RX+PWM8
  Top 0.305: U1.38 16.53,26.65 14.73,28.45 14.73,35.43 16.89,37.59 19.18,37.59 22.23,40.64 26.67,40.64 M8.1
SER6_TX+PWM7
  Top 0.305: U1.37 16.79,27.15 15.24,28.7 15.24,35.18 17.14,37.08 19.43,37.08 22.48,40.13 28.57,40.13 TX6.1
  Bottom 0.305: TX6.1 28.96,41.02 M7.1
SIGN_M
  Top 0.305: 36.2,12.7 36.7,12.7
SIGN_P
  Top 0.305: 34.67,12.7 34.92,12.7 | 34.92,12.7 34.92,12.95 | 34.92,12.7 34.92,12.45 | 34.92,12.7 35.18,12.7
SPI1_MISO  (via drill 0.5)
  Top 0.305: U1.22 26.65,34.27 28.32,35.94 31.88,35.94 v32.38,35.43
  Bottom 0.305: v32.38,35.43 33.78,35.43 34.04,35.69 42.93,35.69 43.94,34.8 45.85,34.8 MISO.1
SPI1_MOSI  (via drill 0.5)
  Top 0.305: U1.23 26.15,34.53 28.07,36.45 33.15,36.45 v33.4,36.2
  Bottom 0.305: v33.4,36.2 44.58,36.2 MOSI.1
SPI1_SCLK  (via drill 0.5)
  Top 0.305: U1.21 27.15,34.01 28.57,35.43 30.73,35.43 v31.37,34.67
  Bottom 0.305: v31.37,34.67 32.77,34.67 33.02,34.92 34.04,34.92 34.29,35.18 42.67,35.18 SCLK.1
SPI3_MISO  (via drill 0.5)
  Top 0.305: U1.56 25.15,21.34 23.75,22.73 v23.75,23.75 | v11.18,21.34 U$4.MISO
  Bottom 0.305: v23.75,23.75 23.11,22.86 U$4.MISO | CAT25512VI-GT3.2 8.76,15.37 11.18,17.78 v11.18,21.34
SPI3_MOSI  (via drill 0.5)
  Top 0.305: U1.57 25.65,21.59 24.64,22.61 v24.64,22.99 | v8.89,17.78 10.16,17.78 U$4.MOSI
  Bottom 0.305: v24.64,22.99 24.26,22.35 14.73,22.35 U$4.MOSI | CAT25512VI-GT3.5 6.22,18.92 7.37,17.78 v8.89,17.78
SPI3_SCLK  (via drill 0.5)
  Top 0.305: U1.55 24.65,21.07 22.61,23.11 v22.61,23.62 | U$4.SCLK 12.19,25.91 9.14,25.91 8.51,26.42 v7.75,26.42
  Bottom 0.305: v22.61,23.62 21.21,23.62 19.43,25.4 U$4.SCLK | v7.75,26.42 7.75,22.61 7.37,22.23 7.37,21.29 CAT25512VI-GT3.6
SWCLK
  Top 0.305: 20.33,19.8 SWDCLK.TP 20.07,19.8 U1.49
SWDIO
  Top 0.305: U1.46 16.3,22.65 15.62,21.97 SWDIO.TP
USB_+5V  (via drill 0.5)
  Top 0.305: v29.46,5.33 29.46,5.21 30.35,4.32 35.05,4.32 35.69,3.68 38.31,3.68 38.31,5.42 v38.48,5.71
  Bottom 0.305: MOLEX_105164-0001.1 30.45,4.35 v29.46,5.33 | v38.48,5.71 38.48,3.52 D1.A
USB_D+
  Bottom 0.305: MOLEX_105164-0001.3 31.75,5.25 R3.2
USB_D-
  Bottom 0.305: MOLEX_105164-0001.2 31.1,6.4 R2.2
VCC_IN  (via drill 0.5)
  Top 0.305: U3.6 46.74,14.43
  Top 0.61: v40.01,13.21 41.27,14.48 41.27,15.24 42,15.96 R13.1 42.97,16.13 45.59,16.13 45.59,16.51 C15.+ 46.74,16.13 46.74,14.43
  Bottom 0.305: D4.C 42.97,8.85
  Bottom 0.61: 42.97,8.85 42.97,10.25 v40.01,13.21
(copper drawn outside any net)
  shapes: Bottom circle x4, Top circle x4